# Altium schematic sheet shield.SchDoc
size B; PageSetup: Record=PageOptions|CenterHorizontal=True|CenterVertical=True|PrintScale=0.72|XCorrection=1.00|YCorrection=1.00|PrintKind=0|BorderSize=5000000|LeftOffset=0|BottomOffset=0|Orientation=2|PaperLength=1000|PaperWidth=1000|Scale=100|PaperSource=7|PrintQuality=-3|MediaType=1|DitherType=10|PrintScaleMode=1|PaperKind=Letter|PaperIndex=1
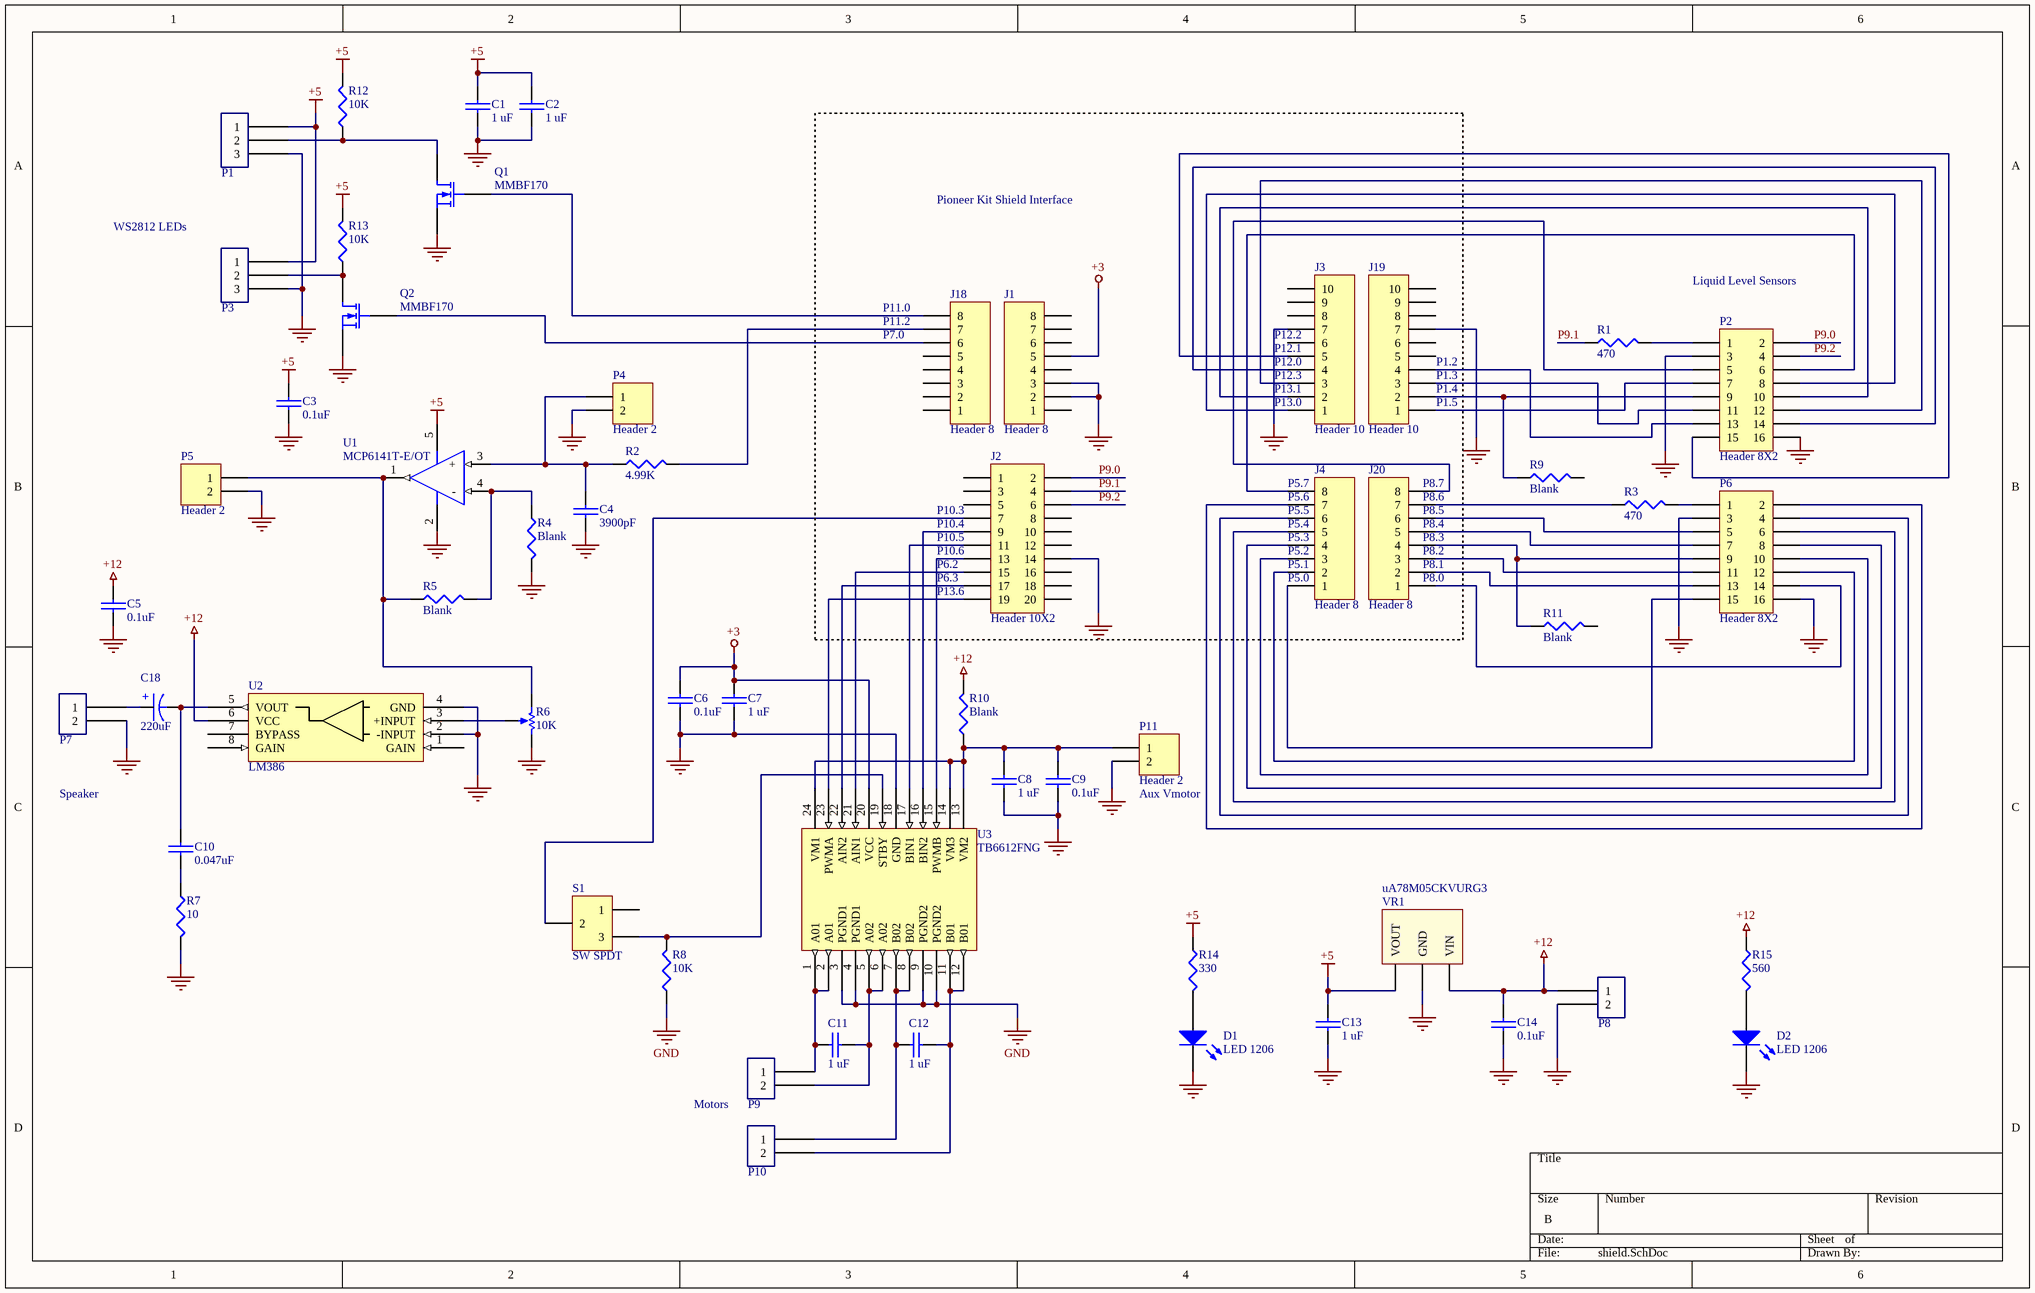
[diagram p0: shield.SchDoc]

## Parts
C1  1 uF  [C0805]
C2  1 uF  [C0805]
C3  0.1uF  [C0603]
C4  3900pF  [C0603]
C5  0.1uF  [C0603]
C6  0.1uF  [C0603]
C7  1 uF  [C0805]
C8  1 uF  [C0805]
C9  0.1uF  [C0603]
C10  0.047uF  [C0603]
C11  1 uF  [C0805]
C12  1 uF  [C0805]
C13  1 uF  [C0805]
C14  0.1uF  [C0603]
C18  value 220uF  [RadCap.98]  (hidden comment: 11-000010-ARD)
D1  LED 1206  [3216[1206]]
D2  LED 1206  [3216[1206]]
J1  Header 8  [HDR1X8]
J2  Header 10X2  [HDR2X10]
J3  Header 10  [HDR1X10]
J4  Header 8  [HDR1X8]
J18  Header 8  [HDR1X8]
J19  Header 10  [HDR1X10]
J20  Header 8  [HDR1X8]
P1  Connector, 0.138", 3  [connector-0.138-3pin]  (value not drawn)
P2  Header 8X2  [HDR2X8]
P3  Connector, 0.138", 3  [connector-0.138-3pin]  (value not drawn)
P4  Header 2  [HDR1X2]
P5  Header 2  [HDR1X2]
P6  Header 8X2  [HDR2X8]
P7  Connector, 0.138", 2  [connector-0.138-2pin]  (value not drawn)
P8  Connector, 0.138", 2  [connector-0.138-2pin]  (value not drawn)
P9  Connector, 0.138", 2  [connector-0.138-2pin]  (value not drawn)
P10  Connector, 0.138", 2  [connector-0.138-2pin]  (value not drawn)
P11  Header 2  [HDR1X2]
Q1  MMBF170  [SOT23]
Q2  MMBF170  [SOT23]
R1  470  [R0603]
R2  4.99K  [R0603]
R3  470  [R0603]
R4  Blank  [R0603]
R5  Blank  [R0603]
R6  value 10K  [TrimmerPot]  (hidden comment: RPot)
R7  10  [R0603]
R8  10K  [R0603]
R9  Blank  [R0603]
R10  Blank  [R0603]
R11  Blank  [R0603]
R12  10K  [R0603]
R13  10K  [R0603]
R14  330  [R0603]
R15  560  [R0603]
S1  SW SPDT  [HDR1X3]
U1  MCP6141T-E/OT  [SOT23-5]
U2  LM386  [SO8]
U3  TB6612FNG  [SSOP-24]
VR1  uA78M05CKVURG3  [TO-252-AB(Dpak)]

## Nets
+3: C6.1(A) C7.1(A) J1.5 U3.20(VCC)
+5: C1.1(A) C2.1(A) C3.1(A) C13.1(A) P1.1 P3.1 R12.2(B) R13.2(B) R14.1(A) U1.5(VCC) VR1.3(VOUT)
+12: C5.1(A) C14.1(A) P8.1 R10.2(B) R15.1(A) U2.6(VCC) VR1.1(VIN)
GND: C1.2(B) C2.2(B) C3.2(B) C4.2(B) C5.2(B) C6.2(B) C7.2(B) C8.2(B) C9.2(B) C13.2(B) C14.2(B) D1.2(K) D2.2(K) J1.2 J1.3 J2.14 J3.7 J19.7 P1.3 P2.3 P2.16 P3.3 P4.2 P5.2 P6.3 P6.16 P7.2 P8.2 P11.2 Q1.2(S) Q2.2(S) R4.2(B) R6.1(TOP) R7.2(B) R8.1(A) U1.2(GND) U2.2(-INPUT) U2.4(GND) U3.3(PGND1) U3.4(PGND1) U3.9(PGND2) U3.10(PGND2) U3.18(GND) VR1.4(GND)
P9.0: J2.2 P2.2
P9.1: J2.4 R1.1(A)
P9.2: J2.6 P2.4
NetC4_1: C4.1(A) P4.1 R2.1(A) U1.3(+)
NetC8_1: C8.1(A) C9.1(A) P11.1 R10.1(A) U3.13(VM2) U3.14(VM3) U3.24(VM1)
NetC10_1: C10.1(A) C18.2(NEGATIVE) U2.5(VOUT)
NetC10_2: C10.2(B) R7.1(A)
NetC11_1: C11.1(A) P9.1 U3.1(A01) U3.2(A01)
NetC11_2: C11.2(B) P9.2 U3.5(A02) U3.6(A02)
NetC12_1: C12.1(A) P10.1 U3.7(B02) U3.8(B02)
NetC12_2: C12.2(B) P10.2 U3.11(B01) U3.12(B01)
NetC18_1: C18.1(POSITIVE) P7.1
NetD1_1: D1.1(A) R14.2(B)
NetD2_1: D2.1(A) R15.2(B)
NetJ2_7: J2.7 S1.2
NetJ2_9: J2.9 U3.16(BIN2)
NetJ2_11: J2.11 U3.17(BIN1)
NetJ2_13: J2.13 U3.15(PWMB)
NetJ2_15: J2.15 U3.21(AIN1)
NetJ2_17: J2.17 U3.22(AIN2)
NetJ2_19: J2.19 U3.23(PWMA)
NetJ3_1: J3.1 P2.8
NetJ3_2: J3.2 P2.10
NetJ3_3: J3.3 P2.12
NetJ3_4: J3.4 P2.14
NetJ3_5: J3.5 P2.15
NetJ4_1: J4.1 P6.15
NetJ4_2: J4.2 P6.12
NetJ4_3: J4.3 P6.10
NetJ4_4: J4.4 P6.8
NetJ4_5: J4.5 P6.6
NetJ4_6: J4.6 P6.4
NetJ4_7: J4.7 P6.2
NetJ4_8: J4.8 P2.6
NetJ18_6: J18.6 Q2.1(G)
NetJ18_7: J18.7 R2.2(B)
NetJ18_8: J18.8 Q1.1(G)
NetJ19_1: J19.1 P2.7
NetJ19_2: J19.2 P2.9 R9.1(A)
NetJ19_3: J19.3 P2.11
NetJ19_4: J19.4 P2.13
NetJ20_1: J20.1 P6.14
NetJ20_2: J20.2 P6.13
NetJ20_3: J20.3 P6.11
NetJ20_4: J20.4 P6.9 R11.1(A)
NetJ20_5: J20.5 P6.7
NetJ20_6: J20.6 P6.5
NetJ20_7: J20.7 R3.1(A)
NetJ20_8: J20.8 P2.5
NetP1_2: P1.2 Q1.3(D) R12.1(A)
NetP2_1: P2.1 R1.2(B)
NetP3_2: P3.2 Q2.3(D) R13.1(A)
NetP5_1: P5.1 R5.1(A) R6.3(BOT) U1.1(OUT)
NetP6_1: P6.1 R3.2(B)
NetR4_1: R4.1(A) R5.2(B) U1.4(-)
NetR6_2: R6.2(TAP) U2.3(+INPUT)
NetR8_2: R8.2(B) S1.3 U3.19(STBY)

Not connected (* = marked no-connect by the designer): J1 1 4 6 7 8; J2 1 3 5 8 10 12 16 18 20; J3 6 8 9 10; J18 1 2 3 4 5; J19 5 6 8 9 10; R9 2(B); R11 2(B); S1 1; U2 1(GAIN) 7(BYPASS) 8(GAIN)

## Notes on the sheet
- WS2812 LEDs
- Pioneer Kit Shield Interface
- Liquid Level Sensors
- (near J18) P11.0
- (near J18) P11.2
- (near J18) P7.0
- (near J3) P12.0
- (near J3) P12.1
- (near J3) P12.2
- (near J19) P1.2
- (near J3) P13.0
- (near J3) P13.1
- (near J3) P12.3
- (near J19) P1.3
- (near J19) P1.4
- (near J19) P1.5
- (near J4) P5.6
- (near J4) P5.7
- (near J20) P8.6
- (near J20) P8.7
- (near J2) P10.4
- (near J2) P10.5
- (near J2) P10.6
- (near J2) P6.2
- (near J2) P10.3
- (near J4) P5.1
- (near J4) P5.2
- (near J4) P5.3
- (near J4) P5.4
- (near J4) P5.5
- (near J20) P8.1
- (near J20) P8.2
- (near J20) P8.3
- (near J20) P8.4
- (near J20) P8.5
- (near J2) P6.3
- (near J2) P13.6
- (near J4) P5.0
- (near J20) P8.0
- Speaker
- (near P11) Aux Vmotor
- Motors
- (in symbol 11-000010-ARD) +

## Library data of the parts
C1 C2 C7 C8 C11-C13 = CAP, CER, 1UF, 0805: CAP, CER, 1UF, 16v, 10%, X5R, 0805; VENDOR: Digikey; VALUE: 1 uF
C3 C5 C6 C9 C14 = CAP, CER, 0.1uF 0603: CAP, CER, 0.1UF, 50V, 10%, X7R, 0603; VENDOR: Digikey; VENDOR_PN: 445-5666-1-ND; VENDOR_LINK: https://www.digikey.com/product-detail/en/tdk-corporation/CGA3E2X7R1H104K080AA/445-5666-1-ND/2443706; VALUE: 0.1uF
C4 C10 = CAP, CER, BLANK, 0603: CAP, CER, blankUF, 6.3v, 10%, X5R, 0603; VENDOR: Digikey
  C4: VALUE: 3900pF
  C10: VALUE: 0.047uF
C18 = 11-000010-ARD: CAP, 220uF, 10V, ELEC, RAD; Right: 20; Bottom: 10; ARMA_PN: 11-000010-ARD
J1 J4 J18 J20 = Header 8: Header, 8-Pin; LatestRevisionDate: 17-Jul-2002; LatestRevisionNote: Re-released for DXP Platform.; Publisher: Altium Limited
J2 = Header 10X2: Header, 10-Pin, Dual row; LatestRevisionDate: 17-Jul-2002; LatestRevisionNote: Re-released for DXP Platform.; Publisher: Altium Limited
J3 J19 = Header 10: Header, 10-Pin; LatestRevisionDate: 17-Jul-2002; LatestRevisionNote: Re-released for DXP Platform.; Publisher: Altium Limited
P1 P3 = Connector, 0.138", 3: Connector, 0.138", 3 pin
P2 P6 = Header 8X2: Header, 8-Pin, Dual row; LatestRevisionDate: 17-Jul-2002; LatestRevisionNote: Re-released for DXP Platform.; Publisher: Altium Limited
P4 P5 P11 = Header 2: Header, 2-Pin; LatestRevisionDate: 17-Jul-2002; LatestRevisionNote: Re-released for DXP Platform.; Publisher: Altium Limited
P7-P10 = Connector, 0.138", 2: Connector, 0.138", 2 pin
Q1 Q2 = MMBF170-7-F: VENDOR_PN: MMBF170-FDICT-ND; VENDOR: Digikey; VALUE: MMBF170; VENDOR_LINK: https://www.digikey.com/products/en?keywords=MMBF170-FDICT-ND
R1-R5 R7-R15 = RES, BLANK, 0603: RES, BLANK OHM, 1/10W, 1%, 0603 SMD; VENDOR: Digikey
  R1 R3: VALUE: 470
  R2: VALUE: 4.99K
  R4 R5 R9-R11: VALUE: Blank
  R7: VALUE: 10
  R8 R12 R13: VALUE: 10K
  R14: VALUE: 330
  R15: VALUE: 560
R6 = RPot: Potentiometer; Set Position: 0.5; Published: 8-Jun-2000; Revision: July-2002: Re-released for DXP Platform.; Publisher: Altium Limited
S1 = Header 3: Header, 3-Pin; LatestRevisionDate: 17-Jul-2002; LatestRevisionNote: Re-released for DXP Platform.; Publisher: Altium Limited
U1 = MCP6141: IC OPAMP SINGLE MCP6141 SOT23-5; Desciption: IC OPAMP SNGL R-R MCP6141 SOT23-5; MFG: Microchip; MFG_PN: MCP6142-E/SN; VENDOR: DIGIKEY; VENDOR_PN: MCP6141T-E/OTCT-ND
U2 = LM386MX: VENDOR: Digikey; VENDOR_PN: LM386MX-1/NOPB; MFG: TI; MFG_PN: LM386MX-1/NOPB; VENDOR_LINK: https://www.digikey.com/product-detail/en/texas-instruments/LM386MX-1-NOPB/LM386MX-1-NOPBCT-ND/3440154; VALUE: LM386; MFG_LINK: http://www.ti.com/lit/ds/symlink/lm386.pdf
U3 = TB6612FNG: VENDOR: Digikey; VENDOR_PN: TB6612FNGC8EL; MFG: Toshiba; MFG_PN: TB6612FNG,C,8,EL; VENDOR_LINK: https://www.digikey.com/product-detail/en/toshiba-semiconductor-and-storage/TB6612FNGC8EL/TB6612FNGC8ELCT-ND/1730134; VALUE: TB6612FNG; MFG_LINK: https://toshiba.semicon-storage.com/info/docget.jsp?did=10660&prodName=TB6612FNG
D1 D2 = LED 1206: Published: 8-Jun-2000; LatestRevisionDate: 17-Jul-2002; LatestRevisionNote: Re-released for DXP Platform.; PackageVersion: Feb-2002; PackageReference: 3.2X1.6X1.1; Publisher: Altium Limited